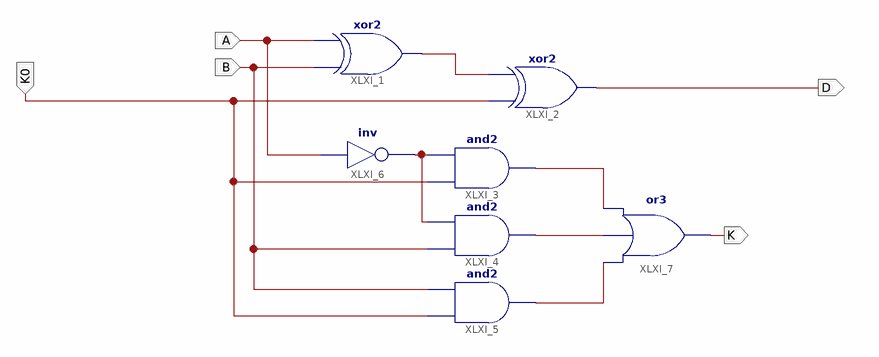
[diagram p0: schematic sheet 1]
// Xilinx ISE schematic Fsub.sch (spartan6) as structural Verilog: 7 symbols, 5 ports
module Fsub (
  input  A,
  input  K0,
  input  B,
  output D,
  output K
);

  wire XLXN_3, XLXN_11, XLXN_15, XLXN_16, XLXN_17;

  xor XLXI_1 (XLXN_3, B, A);
  xor XLXI_2 (D, K0, XLXN_3);
  and XLXI_3 (XLXN_17, K0, XLXN_11);
  and XLXI_4 (XLXN_15, B, XLXN_11);
  and XLXI_5 (XLXN_16, K0, B);
  not XLXI_6 (XLXN_11, A);
  or XLXI_7 (K, XLXN_16, XLXN_15, XLXN_17);
endmodule
